# EAGLE design Block Manager Rev D1 (EAGLE 7.2.0)

## Sheet 1 of 2
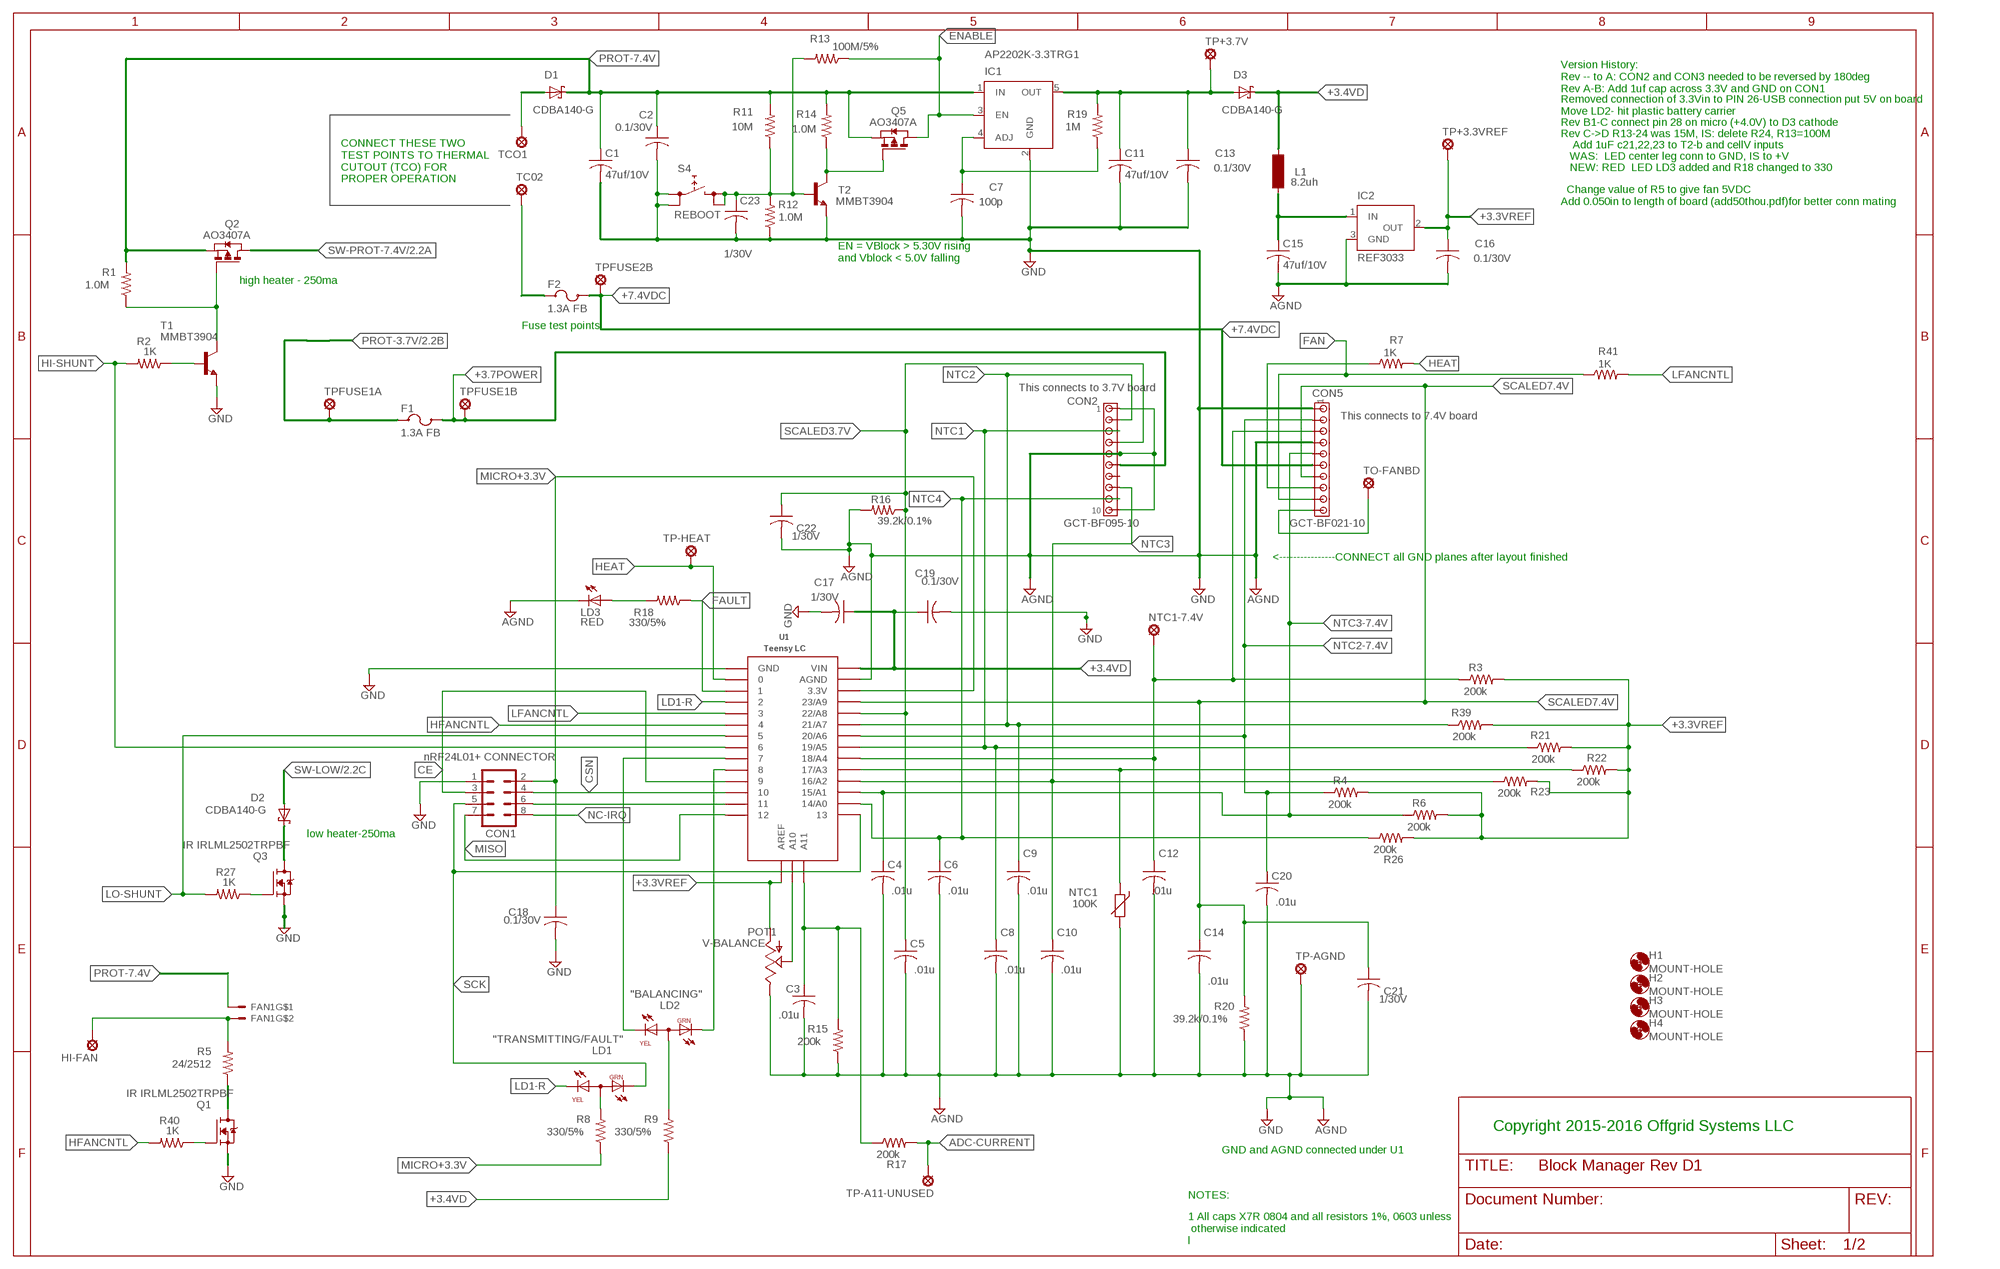
[diagram p0: schematic, sheet 1]

### Parts
C1  47uf/10V  C-USC0805K  [C0805K]
C2  0.1/30V  TIMS_INDUCTOR_C-USC0805  [TIMS_INDUCTOR_C0805]
C3  .01u  TIMS_INDUCTOR_C-USC0805  [TIMS_INDUCTOR_C0805]
C4  .01u  TIMS_INDUCTOR_C-USC0805  [TIMS_INDUCTOR_C0805]
C5  .01u  TIMS_INDUCTOR_C-USC0805  [TIMS_INDUCTOR_C0805]
C6  .01u  TIMS_INDUCTOR_C-USC0805  [TIMS_INDUCTOR_C0805]
C7  100p  TIMS_INDUCTOR_C-USC0805  [TIMS_INDUCTOR_C0805]
C8  .01u  TIMS_INDUCTOR_C-USC0805  [TIMS_INDUCTOR_C0805]
C9  .01u  TIMS_INDUCTOR_C-USC0805  [TIMS_INDUCTOR_C0805]
C10  .01u  TIMS_INDUCTOR_C-USC0805  [TIMS_INDUCTOR_C0805]
C11  47uf/10V  C-USC0805K  [C0805K]
C12  .01u  TIMS_INDUCTOR_C-USC0805  [TIMS_INDUCTOR_C0805]
C13  0.1/30V  TIMS_INDUCTOR_C-USC0805  [TIMS_INDUCTOR_C0805]
C14  .01u  TIMS_INDUCTOR_C-USC0805  [TIMS_INDUCTOR_C0805]
C15  47uf/10V  C-USC0805K  [C0805K]
C16  0.1/30V  TIMS_INDUCTOR_C-USC0805  [TIMS_INDUCTOR_C0805]
C17  1/30V  TIMS_INDUCTOR_C-USC0805  [TIMS_INDUCTOR_C0805]
C18  0.1/30V  TIMS_INDUCTOR_C-USC0805  [TIMS_INDUCTOR_C0805]
C19  0.1/30V  TIMS_INDUCTOR_C-USC0805  [TIMS_INDUCTOR_C0805]
C20  .01u  TIMS_INDUCTOR_C-USC0805  [TIMS_INDUCTOR_C0805]
C21  1/30V  TIMS_INDUCTOR_C-USC0805  [TIMS_INDUCTOR_C0805]
C22  1/30V  TIMS_INDUCTOR_C-USC0805  [TIMS_INDUCTOR_C0805]
C23  1/30V  TIMS_INDUCTOR_C-USC0805  [TIMS_INDUCTOR_C0805]
CON1  nRF24L01+ CONNECTOR  MA04-2  [MA04-2]
CON2  GCT-BF095-10  [GCT-BF085-10]
CON5  GCT-BF021-10  [GCT-BF021-10]
D1  CDBA140-G  [DO214AC]
D2  CDBA140-G  [DO214AC]
D3  CDBA140-G  [DO214AC]
F1  1.3A FB  TE-0603SFV125F  [TE-0603SFV125F]
F2  1.3A FB  TE-0603SFV125F  [TE-0603SFV125F]
FAN1  30mm fan  30X30MMFAN  [30X30MMFAN]
H1  MOUNT-HOLE  [2,6]
H2  MOUNT-HOLE  [2,6]
H3  MOUNT-HOLE  [2,6]
H4  MOUNT-HOLE  [2,6]
HI-FAN  LSP10  [LSP10]
IC1  AP2202K-3.3TRG1  MIC5205  [SOT23-5]
IC2  REF3033  MAX6520  [SOT23]
L1  8.2uh  SM-1206  [SM-1206]
LD1  "TRANSMITTING/FAULT"  KINGBRIGHT-APBA3010  [SUN-XZMDKVG56W]
LD2  "BALANCING"  KINGBRIGHT-APBA3010  [SUN-XZMDKVG56W]
LD3  RED  LITEON-LTST-S270KRKT  [LITEON-LTST-S270KRKT]
NTC1  100K  NTC-MURATA-NCP18WF104J03RB  [0603]
NTC1-7.4V  LSP10  [LSP10]
POT1  V-BALANCE  BOURNS-3361-RA  [BOURNS-3361-RA]
Q1  IRLML2502TRPBF  IRLML2060TRPBF  [SOT23]
Q2  AO3407A  [SOT23-BIGPADS]
Q3  IRLML2502TRPBF  IRLML2060TRPBF  [SOT23]
Q5  AO3407A  [SOT23-BIGPADS]
R1  1.0M  R-US_R0603  [R0603]
R2  1K  R-US_R0603  [R0603]
R3  200k  R-US_R0603  [R0603]
R4  200k  R-US_R0603  [R0603]
R5  24/2512  R-US_R2512  [R2512]
R6  200k  R-US_R0603  [R0603]
R7  1K  R-US_R0603  [R0603]
R8  330/5%  R-US_R0603  [R0603]
R9  330/5%  R-US_R0603  [R0603]
R11  10M  R-US_R0603  [R0603]
R12  1.0M  R-US_R0603  [R0603]
R13  100M/5%  R-US_R0603  [R0603]
R14  1.0M  R-US_R0603  [R0603]
R15  200k  R-US_R0603  [R0603]
R16  39.2k/0.1%  R-US_R0603  [R0603]
R17  200k  R-US_R0603  [R0603]
R18  330/5%  R-US_R0603  [R0603]
R19  1M  R-US_R0603  [R0603]
R20  39.2k/0.1%  R-US_R0603  [R0603]
R21  200k  R-US_R0603  [R0603]
R22  200k  R-US_R0603  [R0603]
R23  200k  R-US_R0603  [R0603]
R26  200k  R-US_R0603  [R0603]
R27  1K  R-US_R0603  [R0603]
R39  200k  R-US_R0603  [R0603]
R40  1K  R-US_R0603  [R0603]
R41  1K  R-US_R0603  [R0603]
S4  REBOOT  PTS645  [PTS645]
T1  MMBT3904  MMBT3904LT1-NPN-SOT23-BEC  [SOT23-BEC]
T2  MMBT3904  MMBT3904LT1-NPN-SOT23-BEC  [SOT23-BEC]
TC02  SOLPAD1.2MMDRILL  [SOLPADWITH1.2MMDRILL]
TCO1  SOLPAD1.2MMDRILL  [SOLPADWITH1.2MMDRILL]
TO-FANBD  LSP10  [LSP10]
TP+3.3VREF  LSP10  [LSP10]
TP+3.7V  LSP10  [LSP10]
TP-A11-UNUSED  LSP10  [LSP10]
TP-AGND  LSP10  [LSP10]
TP-HEAT  LSP10  [LSP10]
TPFUSE1A  LSP10  [LSP10]
TPFUSE1B  LSP10  [LSP10]
TPFUSE2B  LSP10  [LSP10]
U1  Teensy LC  TEENSY_3.0-DIP+ANALOG  [TEENSY_3.0-DIP+ANALOG]

### Nets
4VREFIN: C15.1 IC2.1(IN) L1.1
+3.3VREF: C16.1 IC2.2(OUT) POT1.1(A) R3.2 R4.2 R6.2 R21.2 R22.2 R23.2 R26.2 R39.2 TP+3.3VREF.MP U1.AREF
+3.4VD: C17.1 C19.1 D3.C L1.2 R9.1 U1.VIN
+3.7POWER: CON2.P$6 F1.P$2(2A) TPFUSE1B.MP
+4.5V: C11.1 C13.1 D3.A IC1.5(OUT) R19.2 TP+3.7V.MP
+7.4VDC: CON5.P$6 F2.P$2(2A) TPFUSE2B.MP
ADC-CURRENT: R17.2 TP-A11-UNUSED.MP
ADS: D2.C Q3.3(D)
CE: CON1.3 U1.9
CSN: CON1.4 U1.10
ENABLE: IC1.3(EN) Q5.2(D) R13.1
FAN: CON5.P$9 R41.1
FAULT: R18.1 U1.1
GND: C1.2 C2.2 C3.2 C4.2 C5.2 C6.2 C7.2 C8.2 C9.2 C10.2 C11.2 C12.2 C13.2 C14.2 C15.2 C16.2 C17.2 C18.2 C19.2 C20.2 C21.2 C22.2 C23.2 CON1.1 CON2.P$1 CON2.P$5 CON2.P$10 CON5.P$1 CON5.P$4 IC1.2(GND) IC2.3(GND) LD3.CATHODE(C) NTC1.2 POT1.3(E) Q1.2(S) Q3.2(S) R12.1 R15.1 R16.2 R20.1 S4.1 S4.2 T1.E T2.E TP-AGND.MP U1.AGND U1.GND ; supply symbol labelled AGND
HEAT: R7.2 TP-HEAT.MP U1.0
HEATER: CON5.P$8 R7.1
HFANCNTL: R40.2 U1.4
HI-SHUNT: R2.2 U1.6
LD1-R: LD1.2-CATH-RED(CR) U1.2
LFANCNTL: R41.2 U1.3
LO-SHUNT: R27.2 U1.5
MICRO+3.3V: C18.1 CON1.2 R8.1 U1.3.3V
MISO: CON1.7 U1.12
MOSI: CON1.6 U1.11
N$1: LD3.ANODE(A) R18.2
N$2: D1.A TCO1.MP
N$3: NTC1.1 R22.1 U1.17/A3
N$5: Q2.1(G) R1.1 T1.C
N$9: Q1.3(D) R5.1
N$13: LD2.3-CATH-GRN(CG) U1.8
N$14: LD2.2-CATH-RED(CR) U1.7
N$19: LD1.1-ANODE(A) R8.2
N$20: F2.P$1(1A) TC02.MP
N$21: Q1.1(G) R40.1
N$23: Q3.1(G) R27.1
N$24: C23.1 R11.1 R12.2 R13.2 S4.3 S4.4 T2.B
N$26: C7.1 IC1.4(ADJ) R19.1
N$27: Q5.1(G) R14.1 T2.C
N$28: R2.1 T1.B
N$31: FAN1.2 HI-FAN.MP R5.2
NC-IRQ: CON1.8
NTC1: C8.1 CON2.P$3 R21.1 U1.19/A5
NTC1-7.4V: C12.1 CON5.P$3 NTC1-7.4V.MP R3.1 U1.18/A4
NTC2: C9.1 CON2.P$2 R39.1 U1.21/A7
NTC2-7.4V: C20.1 CON5.P$2 R4.1 U1.20/A6
NTC3: C10.1 CON2.P$8 R23.1 U1.16/A2
NTC3-7.4V: C4.1 CON5.P$5 R6.1 U1.15/A1
NTC4: C6.1 CON2.P$9 R26.1 U1.14/A0
OPENFANBD-PIN: CON5.P$10 TO-FANBD.MP
PROT-3.7V: F1.P$1(1A) TPFUSE1A.MP ; also sheet 2
PROT-7.4V: C1.1 C2.1 D1.C FAN1.1 IC1.1(IN) Q2.3(S) Q5.3(S) R1.2 R11.2 R14.2
SCALED3.7V: C5.1 C22.1 CON2.P$4 R16.1 U1.22/A8
SCALED7.4V: C14.1 C21.1 CON5.P$7 R20.2 U1.23/A9
SCK: CON1.5 LD1.3-CATH-GRN(CG) U1.13
SW-LOW: D2.A ; also sheet 2
SW-PROT-7.4V: Q2.2(D) ; also sheet 2
T: LD2.1-ANODE(A) R9.2
UNUSED-ADC: C3.1 R15.2 R17.1 U1.A11
VBALANCE: POT1.2(S) U1.A10
Unconnected: CON2.P$7

### Notes on the sheet
- Version History:
  Rev -- to A: CON2 and CON3 needed to be reversed by 180deg
  Rev A-B: Add 1uf cap across 3.3V and GND on CON1
- Removed connection of 3.3Vin to PIN 26-USB connection put 5V on board
  Move LD2- hit plastic battery carrier
- Rev B1-C connect pin 28 on micro (+4.0V) to D3 cathode
- Rev C->D R13-24 was 15M, IS: delete R24, R13=100M
- Add 1uF c21,22,23 to T2-b and cellV inputs
- WAS:  LED center leg conn to GND, IS to +V
- NEW: RED  LED LD3 added and R18 changed to 330
- CONNECT THESE TWO
  TEST POINTS TO THERMAL 
  CUTOUT (TCO) FOR 
  PROPER OPERATION
- Change value of R5 to give fan 5VDC 
  Add 0.050in to length of board (add50thou.pdf)for better conn mating
- EN = VBlock > 5.30V rising
  and Vblock < 5.0V falling
- high heater - 250ma
- Fuse test points
- This connects to 3.7V board
- This connects to 7.4V board
- <----------------CONNECT all GND planes after layout finished
- low heater-250ma
- Copyright 2015-2016 Offgrid Systems LLC
- GND and AGND connected under U1
- NOTES:
- 1 All caps X7R 0804 and all resistors 1%, 0603 unless
   otherwise indicated
  l

## Sheet 2 of 2: Shunt/heater
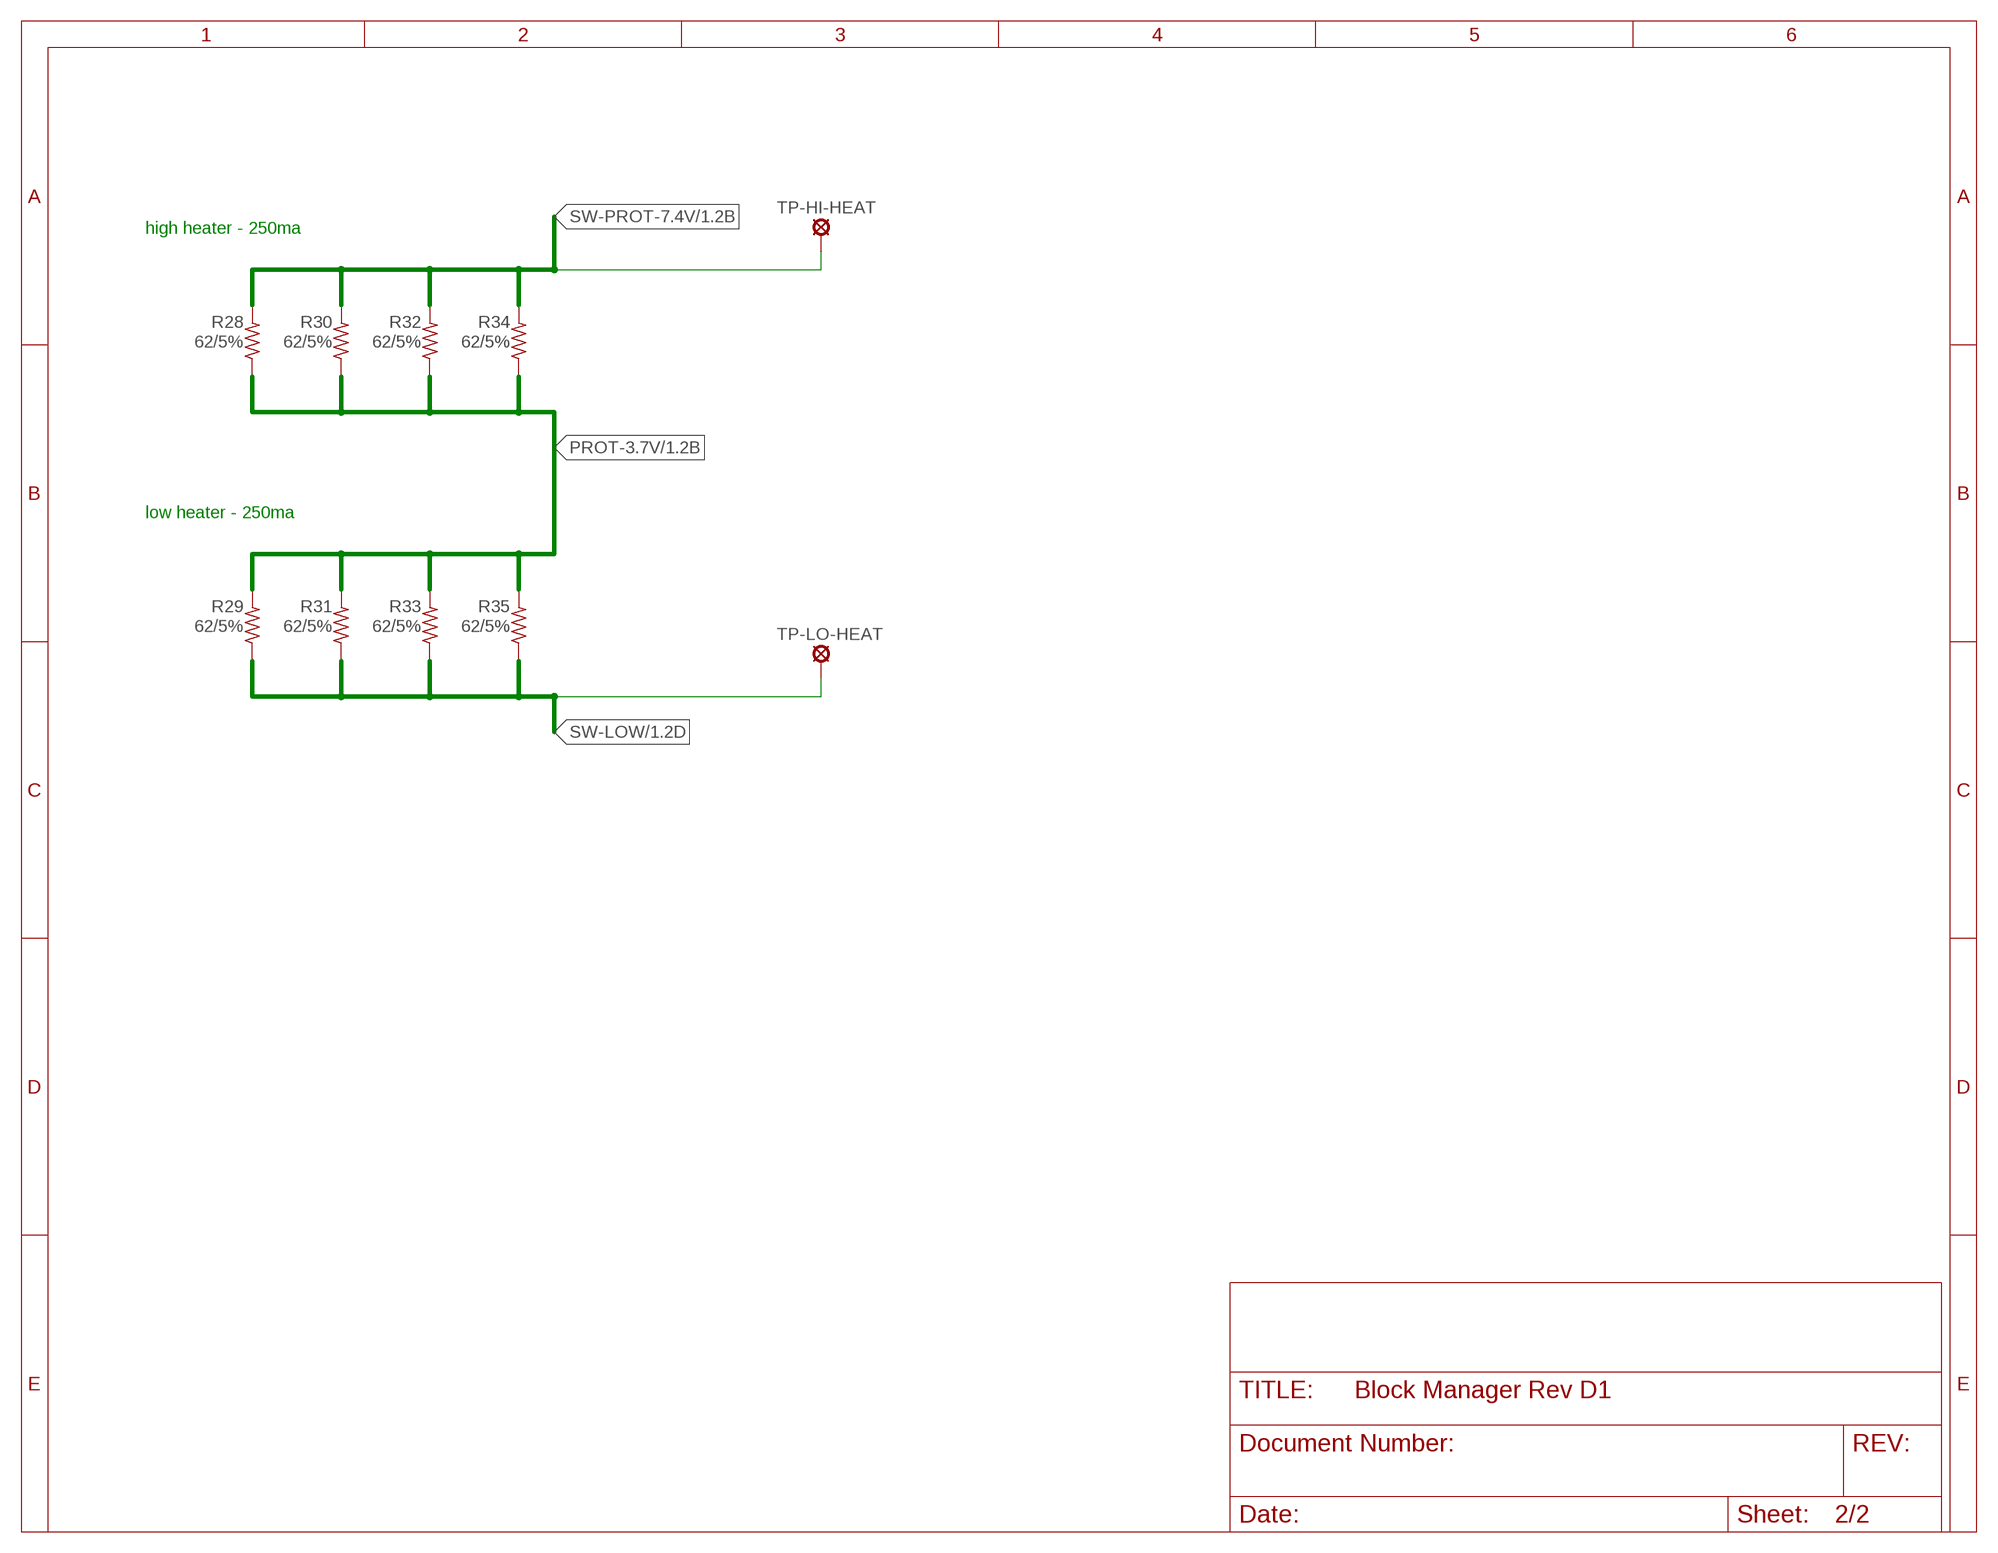
[diagram p1: schematic, sheet 2]

### Parts
R28  62/5%  R-US_R2512  [R2512]
R29  62/5%  R-US_R2512  [R2512]
R30  62/5%  R-US_R2512  [R2512]
R31  62/5%  R-US_R2512  [R2512]
R32  62/5%  R-US_R2512  [R2512]
R33  62/5%  R-US_R2512  [R2512]
R34  62/5%  R-US_R2512  [R2512]
R35  62/5%  R-US_R2512  [R2512]
TP-HI-HEAT  LSP10  [LSP10]
TP-LO-HEAT  LSP10  [LSP10]

### Nets
PROT-3.7V: R28.1 R29.2 R30.1 R31.2 R32.1 R33.2 R34.1 R35.2 ; also sheet 1
SW-LOW: R29.1 R31.1 R33.1 R35.1 TP-LO-HEAT.MP ; also sheet 1
SW-PROT-7.4V: R28.2 R30.2 R32.2 R34.2 TP-HI-HEAT.MP ; also sheet 1

### Notes on the sheet
- high heater - 250ma
- low heater - 250ma

## Library data of the parts
C1 C15 = offgrid rcl:C-US: CAPACITOR, American symbol; 1KPRICE: .271; MPN: Murata GRM21BR61A476ME15L
C2 = Power_board:TIMS_INDUCTOR_C-US: CAPACITOR, American symbol; 100PCPRICE: .022; 1KPRICE: .012; MPN: Kemet C0805C104K5RACTU
C3-C6 C8-C10 C12 C14 C18-C20 = Power_board:TIMS_INDUCTOR_C-US: CAPACITOR, American symbol; MPN: Kemet C0805C103K5RACTU
C7 C13 C16 C17 C21-C23 = Power_board:TIMS_INDUCTOR_C-US: CAPACITOR, American symbol; MPN: Kemet C0805C104K5RACTU
C11 = offgrid rcl:C-US: CAPACITOR, American symbol; 100PCPRICE: .39; 1KPRICE: .271; MPN: Murata GRM21BR61A476ME15L
CON1 = con-lstb:MA04-2: PIN HEADER; 100PCPRICE: 0.53; 1KPRICE: 0.38; MPN: Precidip 803-87-008-10-012101; OC_FARNELL: unknown; OC_NEWARK: unknown
CON2 = offgrid con-amp:GCT-BF095-10: GCT Bf095 series 2.00mm 2mm socket single row through hole vertical THP
CON5 = offgrid con-amp:GCT-BF021-10: GCT BF021-10 also Sullins 40 pos header NRPN401PARN-RC conn header 2mm single RA through hole horizontal
D1-D3 = offgrid diode:CDBA140-G: Comchip CDBA140-G DIODE SCHOTTKY 40V 1A DO214AC; 100PCPRICE: .187; 1KPRICE: .068; MPN: comchip CDBA140-G
F1 = offgrid fuse:TE-0603SFV125F: TE connectivity pn 0603SFV125F which is a SMT 0603 fuse rated at 32VDC and 1.3Amps, fast blow. Note that this fuse comes in many different ratings.; 100PCPRICE: .20; 1KPRICE: .134; MPN: TE 0603SFV125F/32-2
F2 = offgrid fuse:TE-0603SFV125F: TE connectivity pn 0603SFV125F which is a SMT 0603 fuse rated at 32VDC and 1.3Amps, fast blow. Note that this fuse comes in many different ratings.; 100PCPRICE: .20; 1KPRICE: .134; MPN: TE 0603SFV125F
FAN1 = offgrid con-molex:30X30MMFAN: 30mm x 30mm fan with 24mm holes on center; MPN-FAN: TBD
H1-H4 = holes:MOUNT-HOLE: MOUNTING HOLE with drill center marker
HI-FAN NTC1-7.4V TO-FANBD TP+3.3VREF TP+3.7V TP-A11-UNUSED TP-AGND TP-HEAT TP-HI-HEAT TP-LO-HEAT TPFUSE1A TPFUSE1B TPFUSE2B = solpad:LSP10: SOLDER PAD drill 1.0 mm, distributor Buerklin, 12H555
IC1 = offgrid v-reg-micrel:MIC5205: VOLTAGE REGULATOR; 100PCPRICE: .23; 1KPRICE: .103; MF: Diodes INc; MPN: Diodes AP2202K-3.3TRG1; OC_FARNELL: 1100656; OC_NEWARK: 09J8939
IC2 = maxim:MAX6520: 1.2V Voltage Reference 50ppm/°C, SOT23, 3-Terminal Source: Data sheet <http://datasheets.maxim-ic.com/en/ds/MAX6520.pdf>; 100PCPRICE: 1.25; 1KPRICE: .675; MF: MAXIM; MPN: TI REF3033AIDBZR; OC_FARNELL: unknown; OC_NEWARK: 02J4586
L1 = offgrid-inductor-neosid:SM-1206: INDUCTOR SMD chip inductor; 100PCPRICE: .136; 1KPRICE: .10; MPN: Abracon AIML-1206-8R2K-T
LD1 LD2 = led:KINGBRIGHT-APBA3010; MPN: Kingbright APBA3010SYKCGKC-GX
LD3 = offgrid led:LITEON-LTST-S270KRKT: LITEON-LTST-S270KRKT side looking SMT on a slightly smaller than 0805 pad; MPN: LITEON-LTST-S270KRKT
NTC1 = offgrid varistor:NTC-MURATA-NCP18WF104J03RB: Murata NCP18WF104J03RB 100K NTC 5%; 100PCPRICE: .106; 1KPRICE: .07999; MPN: MURATA NCP18WF104J03RB
POT1 = offgrid pot:BOURNS-3361-RA: Bourns 1/4" square SMD trimpot pot trimming potentiometer in right angle mount; MPN: Bourns 3361S-1-104GLF
Q1 Q3 = offgrid transistor-fet:IRLML2060TRPBF: IR IRLML2060TRPbF low cost MOSFET in SOT23, 1.5A, 500mohm N channel 60V; 100PCPRICE: .144; 1KPRICE: .11; MPN: IR IRLML2502TRPBF
Q2 = offgrid zetex:AO3407A: P channel MOSFET or pmos with larger pads in SOT23 or SOT-23 3 in package; 100PCPRICE: .203; 1KPRICE: .092; MPN: Alpha AO3407A
Q5 = offgrid zetex:AO3407A: P channel MOSFET or pmos with larger pads in SOT23 or SOT-23 3 in package
R1 R12 R14 R19 = rcl:R-US_: RESISTOR, American symbol; 100PCPRICE: .0187; 1KPRICE: .0084; MPN: Bourns CR0603-FX-1004ELF
R2 R7 R27 R40 R41 = rcl:R-US_: RESISTOR, American symbol; 100PCPRICE: .018; 1KPRICE: .0084; MPN: Bourns CR0603-FX-1001ELF
R3 R4 R6 R17 R21-R23 R26 R39 = rcl:R-US_: RESISTOR, American symbol; 100PCPRICE: .018; 1KPRICE: .007; MPN: Bourns CR0603-FX-2003ELF
R5 = rcl:R-US_: RESISTOR, American symbol; 100PCPRICE: .12; 1KPRICE: .05; MPN: Rohm MCR100JZHJ240
R8 = rcl:R-US_: RESISTOR, American symbol; 100PCPRICE: .011; 1KPRICE: .005; MPN: Bourns CR0603-JW-331ELF
R9 = rcl:R-US_: RESISTOR, American symbol; MPN: Bourns CR0603-JW-331ELF
R11 = rcl:R-US_: RESISTOR, American symbol; 100PCPRICE: .0117; 1KPRICE: .00525; MPN: Bourns CR0603-JW-106ELF
R13 = rcl:R-US_: RESISTOR, American symbol; 100PCPRICE: .1276; 1KPRICE: .007040; MPN: Stackpole HMC0603JT100M
R15 R18 = rcl:R-US_: RESISTOR, American symbol; 100PCPRICE: .18; 1KPRICE: .07; MPN: Bourns CR0603-FX-2003ELF
R16 R20 = rcl:R-US_: RESISTOR, American symbol; 100PCPRICE: .161; 1KPRICE: .079; MPN: Susumu RG1608P-3922-B-T5
R28-R35 = rcl:R-US_: RESISTOR, American symbol; 100PCPRICE: .12; 1KPRICE: .05; MPN: Rohm MCR100JZHJ620
S4 = offgrid switch:PTS645; 100PCPRICE: 0.176; 1KPRICE: 0.11; MPN: C&k PTS645SM43SMTR92 LFS
T1 T2 = offgrid transistor:*-NPN-: NPN Transistror BF959 corrected 2008.03.06; 100PCPRICE: .062; 1KPRICE: .02; MPN: NXP MMBT3904,215
TC02 TCO1 = solpad:SOLPAD1.2MMDRILL
U1 = Teensy3.0v1.1:TEENSY_3.0-DIP+ANALOG: Teensy 3.0, 3.1 PCB layout with 0.043 holes for .025sq pins; 1KPRICE: 9.99; LOPROFILE-PINHEADER: Millmax 800-10-045-10-002000; LOPROFILE-SOCKET: Precidip 315-87-160-41-003101; MATCHING-SOCKET: 3M 929850-01-13-RA; MPN: OshPark Teensy 3.1; PIN-HEADER: TE Conn 1-644456-3

## Board
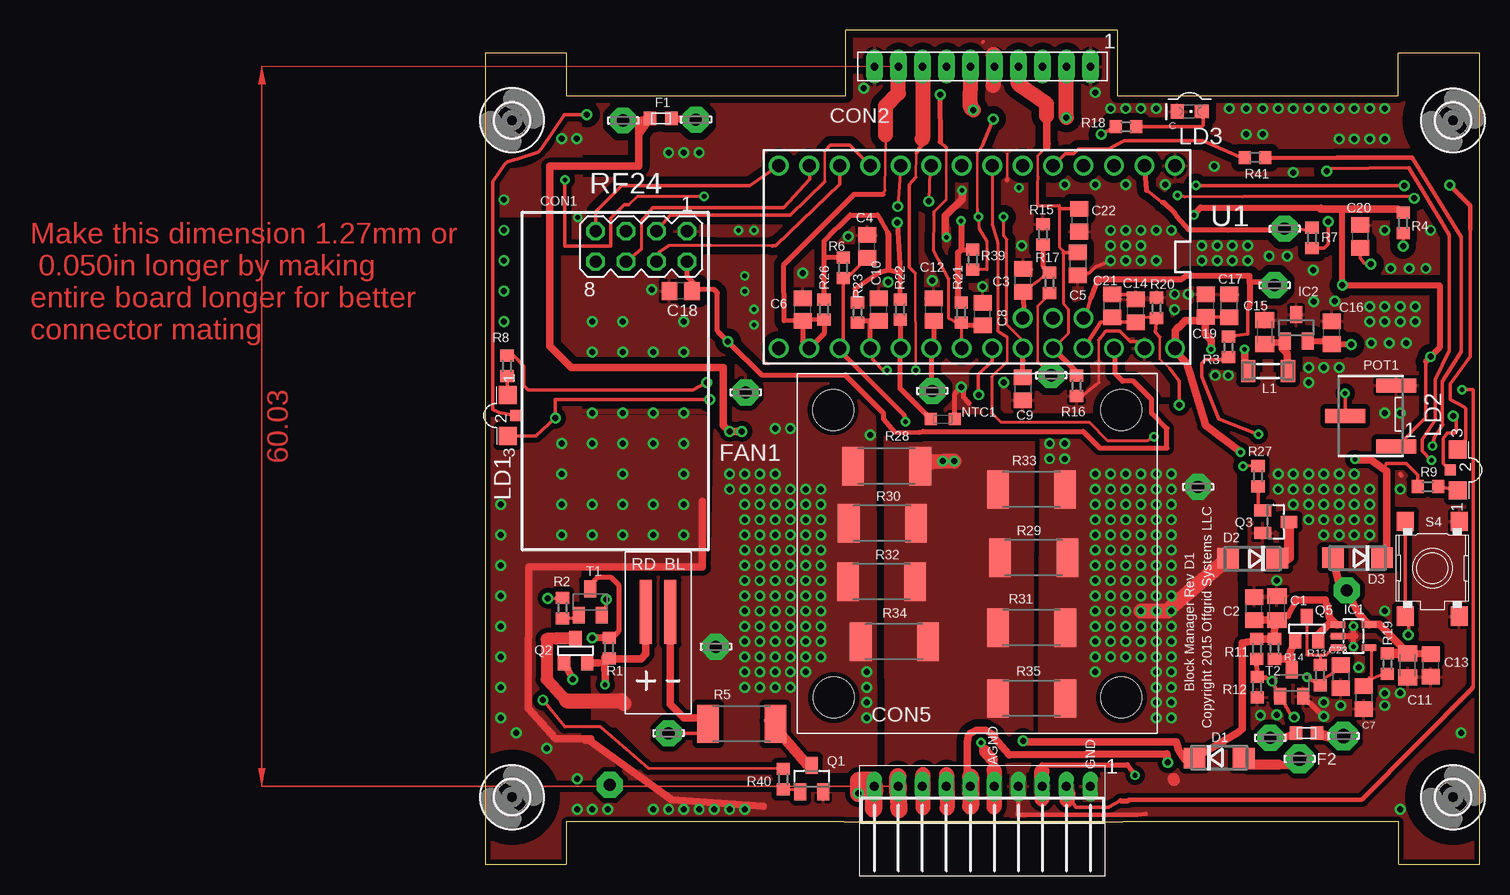
[diagram p2: board, top side]
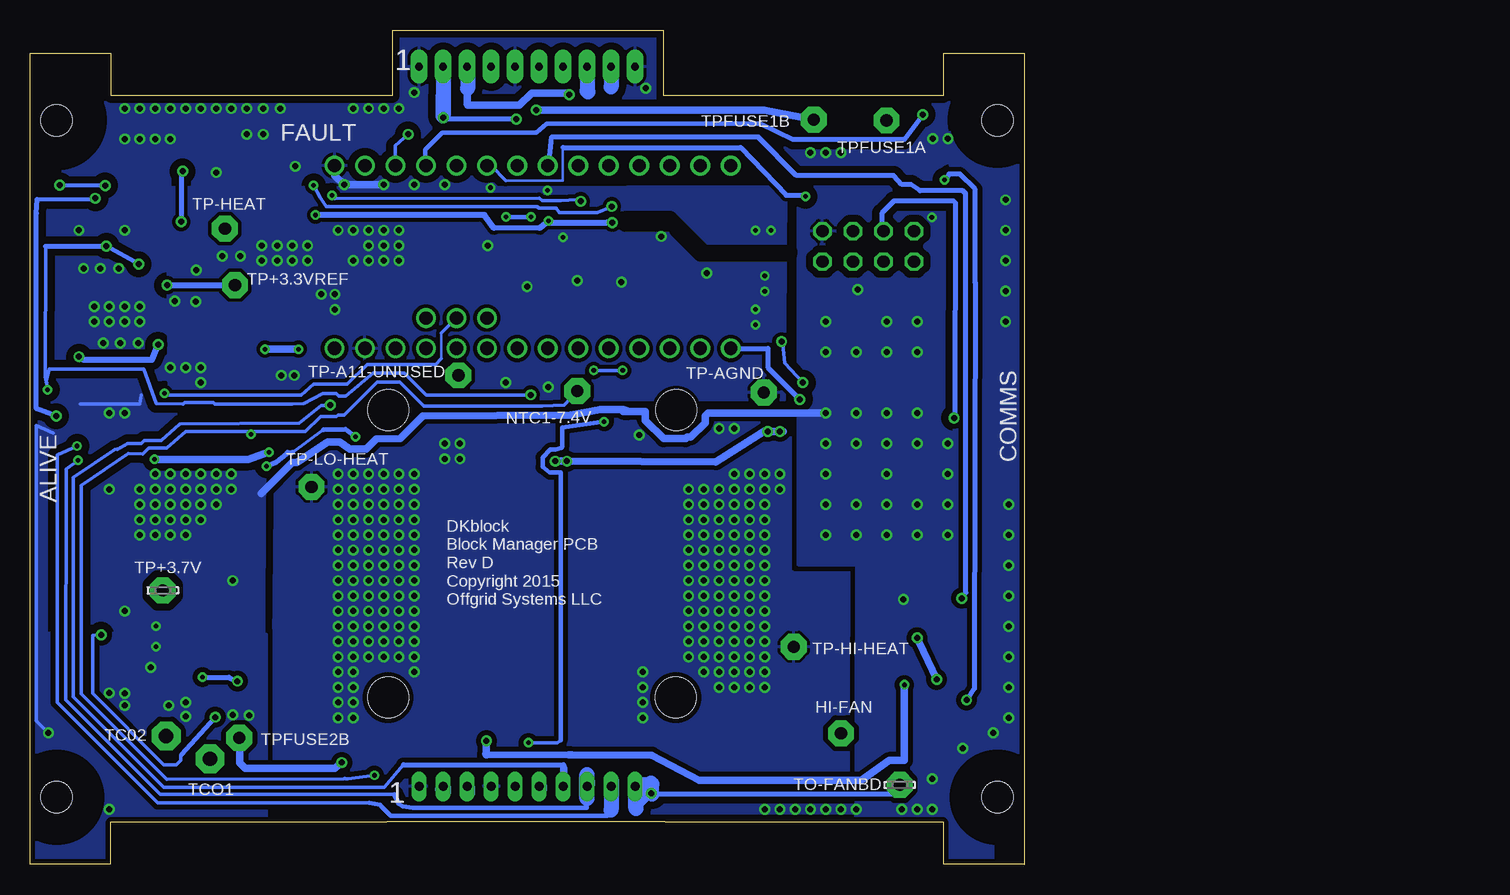
[diagram p3: board, bottom side, seen from below]

Size 82.85 x 69.59 mm. Coordinates in mm from the lower left corner, seen from the top.
Outline: 82.85,0.01 82.85,67.67 76.09,67.67 76.09,64.11 52.64,64.12 52.64,69.59 30.05,69.59 30.05,64.11 6.75,64.11 6.75,67.67 0.01,67.67 0.01,0
Outline: 0,0.01 6.76,0.01 6.76,3.56 29.76,3.56 29.92,3.56 53.1,3.56 53.1,3.56 76.1,3.56 76.1,0.01 82.85,0.01
Copper layers (1*16): Top 0.035mm / dielectric 1.5mm / Bottom 0.035mm
Design rules "Tims design rules for low voltage boards up to 48VDC for BM board": minimum track width 9mil, minimum drill 15mil, track to track 11mil, track to pad 11mil, pad to pad 11mil, via to via 11mil, smd to smd 4mil, copper to edge 12mil, drill to drill 5mil, minimum pad ring 10mil, minimum via ring 8mil, stop-mask expansion 4mil, vias tented up to drill 30mil, thermal gap 10mil
bRestrict: area 19.8,50.9 to 33.2,53.9

### Footprints (pad centres in the part's own frame; a part is rotated, then mirrored left to right if it is on the bottom)
C0805K = smd 1.3 x 1.6: 1 -1,0; 2 1,0
TIMS_INDUCTOR_C0805 = smd 1.3 x 1.5: 1 -0.95,0; 2 0.95,0
MA04-2 = drill 1.016 octagon: 1 -3.81,-1.27; 2 -3.81,1.27; 3 -1.27,-1.27; 4 -1.27,1.27; 5 1.27,-1.27; 6 1.27,1.27; 7 3.81,-1.27; 8 3.81,1.27
GCT-BF085-10 = drill 0.66 pad 1.422 long: P$1 9,0; P$2 7,0; P$3 5,0; P$4 3,0; P$5 1,0; P$6 -1,0; P$7 -3,0; P$8 -5,0; P$9 -7,0; P$10 -9,0
GCT-BF021-10 = drill 0.75 long: P$1 9,-0.5; P$2 7,-0.5; P$3 5,-0.5; P$4 3,-0.5; P$5 1,-0.5; P$6 -1,-0.5; P$7 -3,-0.5; P$8 -5,-0.5; P$9 -7,-0.5; P$10 -9,-0.5
DO214AC = smd 1.8 x 1.7: A 2.05,0; C -2.05,0
TE-0603SFV125F = smd 1.092 x 1.092: P$1 -0.908,0; P$2 0.861,0
30X30MMFAN = smd 1 x 5.334: 1 -27.54,-5.415; 2 -25.5,-5.415 | hole 3.404: -11.942,11.438; 12.067,11.433; -11.887,-12.532; 12.082,-12.537
2,6 = hole 2.591: 0,0
LSP10 = drill 1.016 pad 2.159 octagon: MP 0,0
SOT23-5 = smd 0.55 x 1.2: 1 -0.95,-1.3; 2 0,-1.3; 3 0.95,-1.3; 4 0.95,1.3; 5 -0.95,1.3
SOT23 = smd 1 x 1.4: 1 -0.95,-1.1; 2 0.95,-1.1; 3 0,1.1
SM-1206 = smd 1.2 x 1.8: 1 -1.65,0; 2 1.65,0
SUN-XZMDKVG56W = smd 1.5 x 1.5: 1-ANODE -1.72,0; 3-CATH-GRN 1.72,0 | smd 0.9 x 0.9: 2-CATH-RED 0,0.65
LITEON-LTST-S270KRKT = smd 1.1 x 1.2: ANODE 0,1 | smd 1.2 x 1.1: CATHODE 0,-1.05
0603 = smd 1 x 1: 1 -1,0; 2 1,0
BOURNS-3361-RA = smd 3.302 x 1.194: 1 2.127,-2.547; 2 -2.127,0; 3 2.127,2.547
SOT23-BIGPADS = smd 1.016 x 1.27: 1 0.991,1.016; 2 0.025,-1.016; 3 -0.94,1.016
R0603 = smd 1 x 1.1: 1 -0.85,0; 2 0.85,0
R2512 = smd 1.8 x 3.2: 1 -2.8,0; 2 2.8,0
PTS645 = smd 1.6 x 1.4: 1 -4.2,2.25; 2 3.7,2.25; 3 -4.2,-2.25; 4 3.7,-2.25
SOT23-BEC = smd 1 x 1.4: B -0.95,-1.1; C 0,1.1; E 0.95,-1.1
SOLPADWITH1.2MMDRILL = drill 1.2 pad 2.4 octagon: MP 0,0
TEENSY_3.0-DIP+ANALOG = drill 1.1: 0 -7.62,13.97; 1 -7.62,11.43; 2 -7.62,8.89; 3 -7.62,6.35; 3.3V 7.62,11.43; 4 -7.62,3.81; 5 -7.62,1.27; 6 -7.62,-1.27; 7 -7.62,-3.81; 8 -7.62,-6.35; 9 -7.62,-8.89; 10 -7.62,-11.43; 11 -7.62,-13.97; 12 -7.62,-16.51; 13 7.62,-16.51; 14/A0 7.62,-13.97; 15/A1 7.62,-11.43; 16/A2 7.62,-8.89; 17/A3 7.62,-6.35; 18/A4 7.62,-3.81; 19/A5 7.62,-1.27; 20/A6 7.62,1.27; 21/A7 7.62,3.81; 22/A8 7.62,6.35; 23/A9 7.62,8.89; A10 5.08,6.35; A11 5.08,3.81; AGND 7.62,13.97; AREF 5.08,8.89; GND -7.62,16.51; VIN 7.62,16.51

### Placement (x,y rotation side)
C1  65.96,21.39 90 top
C2  64.06,21.34 90 top
C3  44.81,48.72 90 top
C4  31.81,51.54 90 top
C5  49.36,50.09 270 top
C6  26.44,46.28 90 top
C7  73.2,13.92 270 top
C8  41.43,45.9 90 top
C9  44.79,39.67 270 top
C10  32.79,46.28 90 top
C11  76.86,16.61 270 top
C12  37.36,46.28 90 top
C13  78.77,16.61 270 top
C14  54.2,46.18 90 top
C15  64.95,44.4 90 top
C16  70.54,44.35 90 top
C17  62,46.58 90 top
C18  16.28,47.8 180 top
C19  60.05,46.61 90 top
C20  72.92,52.38 90 top
C21  52.25,46.58 90 top
C22  49.51,53.72 270 top
C23  71.27,15.67 270 top
CON1  13,51.54 180 top
CON2  41.43,66.54 0 top
CON5  41.42,7.01 0 top
D1  61.15,8.89 0 top
D2  63.94,25.53 180 top
D3  72.67,25.58 180 top
DRILEGEND  [DRILEGEND]  12.85,-8.09 0 top  (outside the outline)
F1  14.63,62.22 0 top
F2  68.4,10.95 180 top
FAN1  40.92,26.47 0 top
H1  2.22,5.62 0 top
H2  80.64,5.62 0 top
H3  80.63,62.05 0 top
H4  2.22,62.05 0 top
HI-FAN  15.27,10.95 0 top
IC1  72.34,19.05 270 top
IC2  67.56,44.76 0 top
L1  65.23,41.15 180 top
LD1  1.86,37.44 270 top
LD2  81.05,32.89 90 top
LD3  58.7,62.79 270 top
NTC1  38.13,37.13 0 top
NTC1-7.4V  37.24,39.49 0 top
POT1  73.78,37.4 0 top
Q1  27.2,7.16 0 top
Q2  7.54,17.83 180 top
Q3  65.87,28.58 270 top
Q5  68.48,19.66 180 top
R1  10.31,18.06 270 top
R2  6.43,21.39 90 top
R3  61.93,43.15 90 top
R4  76.48,53.49 90 top
R5  21.36,11.73 180 top
R6  29.82,49.76 90 top
R7  68.89,52.25 90 top
R8  1.8,41.58 270 top
R9  78.54,31.52 0 top
R11  64.29,17.98 90 top
R12  64.31,14.78 90 top
R13  69.57,15.8 270 top
R14  65.76,17.98 90 top
R15  46.46,52.56 270 top
R16  49.27,39.93 270 top
R17  47.02,48.51 270 top
R18  53.39,61.52 0 top
R19  75.16,16.74 90 top
R20  55.93,46.41 270 top
R21  39.65,46.02 90 top
R22  34.57,46.28 90 top
R23  31.01,46.02 90 top
R26  28.22,46.28 90 top
R27  64.39,32.39 90 top
R28  33.44,33.22 180 top
R29  45.7,25.59 180 top
R30  33.08,28.45 180 top
R31  45.52,19.77 180 top
R32  33.01,23.57 180 top
R33  45.51,31.27 180 top
R34  34.08,18.59 180 top
R35  45.52,13.86 180 top
R39  40.62,50.44 90 top
R40  24.82,7.11 90 top
R41  64.14,58.94 180 top
S4  78.92,24.41 270 top
T1  8.74,21.89 0 top
T2  67.21,15.14 0 top
TC02  71.5,10.72 0 top
TCO1  67.84,8.81 0 top
TO-FANBD  10.37,6.64 0 bottom
TP+3.3VREF  65.76,48.31 0 top
TP+3.7V  71.78,22.86 0 bottom
TP-A11-UNUSED  47.15,40.79 0 top
TP-AGND  21.69,39.37 0 top
TP-HEAT  66.6,53.02 0 top
TP-HI-HEAT  19.2,18.16 0 top
TP-LO-HEAT  59.39,31.5 0 top
TPFUSE1A  11.47,62.04 0 top
TPFUSE1B  17.54,62.12 0 top
TPFUSE2B  65.41,10.57 0 top
U1  40.96,50.66 270 top

### Tracks (layer width: path | path; a pad name or v marks a point on that pad's centre or on a via)
4VREFIN
  Top 0.305: IC2.1 65.2,43.66 C15.1 66.41,43.4
  Top 0.61: 66.41,43.4 66.41,43.02 66.83,42.6 66.83,41.2 L1.1
+3.3VREF  (via drill 0.38, 0.5)
  Top 0.305: 76.54,54.41 R4.2 | v71.43,48.31 71.43,48.16 | 71.4,54.46 71.6,54.66 | 69.92,43.66 C16.1 70.57,43.4 71.13,43.16 | 71.13,43.16 70.51,43.31 | 50.43,47.23 49.98,45.58 U1.AREF | 63.68,46.63 63.53,46.48 63.53,44.23 R3.2 | POT1.1 75.98,34.85 78.39,37.26 78.39,41.96 | 70.55,43.36 71.13,43.16
  Top 0.406: R22.2 34.57,49.33 | 34.57,49.33 33.55,49.58 32.79,49.33 30.81,48.01 30.76,47.13 R23.2 | R21.2 39.65,47.04 39.4,47.3 | R26.2 28.22,50.45 | 28.22,50.45 28.22,51.99 29.21,52.98 29.39,53.14 30.4,54.15 32.69,54.15 33.55,52.63 | v34.32,53.52 34.57,49.33 | TP+3.3VREF.MP 66.17,48.31 65.91,48.56 | 51.03,48.79 50.43,47.23 | 69.62,54.79 69.62,54.66 | 39.65,51.3 R39.2 | R6.2 28.38,50.61 28.22,50.45
  Top 0.508: 39.4,47.3 39.4,51.04 39.65,51.3 v39.65,53.67 | 33.55,52.63 33.55,49.58 | 65.91,48.56 63.68,48.51 | 63.68,48.51 63.68,49.07 58.4,49.07 57.99,48.79 51.03,48.79 | v59.06,54.15 59.59,54.79 69.62,54.79 | 71.43,48.16 71.4,49.58 71.4,54.46 | IC2.2 69.92,43.66 | 63.68,48.51 63.68,46.63 | 78.39,41.96 v78.77,42.34 79.53,43.1 79.53,48.31 v71.43,48.31 | v72.16,43.36 70.55,43.36
  Top 0.61: 69.62,54.66 71.6,54.66 74.25,54.66 | 74.25,54.66 76.05,54.66 76.38,54.33 76.63,54.37 R4.2 | 74.22,54.64 74.25,54.66
  Bottom 0.305: v78.77,42.34 78.39,42.09
  Bottom 0.406: 39.6,53.54 39.65,53.77 v39.65,53.67 39.68,53.64 | 34.77,53.54 v34.32,53.52 | 40.39,53.09 44.2,53.09
  Bottom 0.508: 39.6,53.54 34.77,53.54 | 39.68,53.64 40.39,53.09 | 44.2,53.09 44.98,54.15 v59.06,54.15 | v71.43,48.31 TP+3.3VREF.MP | 78.39,42.09 72.67,42.09 v72.16,43.36
+3.4VD  (via drill 0.38)
  Top 0.305: 59.59,45.3 C19.1 61.98,45.66 C17.1 | R9.1 77.69,32.5 76.73,33.45 75.08,33.45 75.08,33.34 74.79,33.05
  Top 0.406: U1.VIN 57.47,42.81 | 59.97,45.61 C19.1
  Top 0.61: 57.47,42.81 58.45,41.83 60.02,36.63 v62.94,34.39 | U1.VIN 57.47,44.54 57.76,44.83 57.84,44.83 58.34,45.34 59.55,45.34 C19.1 | v72.47,33.78 72.52,33.73 73.84,33.73 74.79,33.05 75.11,32.82 75.11,26.44 74.93,26.04 74.93,25.54 74.72,25.54 D3.C | v63.27,42.98 63.32,41.27 63.45,41.15 L1.2 | v60.48,42.98 60.48,43.74 59.97,44.25 59.97,45.61
  Bottom 0.61: v72.47,33.78 64.64,33.78 v62.94,34.39 | v63.27,42.98 v60.48,42.98
+3.7POWER  (via drill 0.5)
  Top 0.61: TPFUSE1B.MP 15.87,62.21 F1.P$2
  Top 1.27: CON2.P$6 40.43,65.51 40.41,63.48 40.41,63.17 v40.67,62.92
  Bottom 0.61: v40.67,62.92 21.65,62.92 TPFUSE1B.MP
+4.5V
  Top 0.61: D3.A 71.13,23.51 TP+3.7V.MP 72.78,20.9 IC1.5 73.83,20.04 74.52,20.04 74.7,19.86 74.7,19.84 75.36,19.18 75.36,19.15 76.71,17.81 C11.1 76.76,17.61 C13.1
  Top 0.813: C11.1 75.13,17.56 R19.2
+7.4VDC  (via drill 0.5)
  Top 0.254: 40.44,7.31 40.44,7.29 40.46,7.27
  Top 0.61: F2.P$2 66.63,10.62 65.86,10.36 TPFUSE2B.MP | v56.87,8.51 56.8,8.51 56.8,9.22 | 56.92,8.56 56.8,9.22 | 56.8,9.22 43.66,9.17 42.44,10.52 42.44,10.77 41.68,11.2 40.92,11.2 40.41,10.92 40.26,10.72 40.17,10.2 40.17,7.61 40.46,7.32 CON5.P$6
  Top 1.422: 40.44,7.31 40.44,5.98 | 40.44,5.98 40.44,4.87 | CON5.P$6 40.44,5.98
  Bottom 0.254: 40.42,6.13 40.42,5.82 40.45,5.95 CON5.P$6
  Bottom 0.61: TPFUSE2B.MP 65.36,8.48 64.9,8.03 57.46,8.03 v56.87,8.51
  Bottom 1.27: 40.42,6.63 CON5.P$6 40.42,6.13
ADC-CURRENT
  Top 0.229: 46.03,41.96 46.03,46.56
  Top 0.254: TP-A11-UNUSED.MP 47.15,40.82 46.03,41.96 | R17.2 47.17,47.7 46.03,46.56
ADS
  Top 0.813: Q3.3 66.94,28.23 66.96,25.6 66.4,25.53 66.62,25.35 D2.C
CE
  Top 0.229: 28.27,56.95 28.27,59.49
  Top 0.305: CON1.3 14.27,52.87 15.39,54.15 25.43,54.15 28.27,56.95 | 28.27,59.49 28.73,59.99 30.35,59.99 U1.9
CSN
  Top 0.254: 23.9,51.59 18.9,51.61 15.27,51.61
  Top 0.305: U1.10 29.53,56.73 24.21,51.61 23.95,51.61 23.9,51.59 | 15.27,51.61 14.5,51.05 CON1.4
ENABLE
  Top 0.254: Q5.2 68.43,17.5 69.62,17.5 | 69.62,17.5 70.13,17.5 70.56,18.01 IC1.3 | R13.1 69.62,17.5
FAN  (via drill 0.38)
  Top 0.305: v78.92,34.9 79.12,35.71 79.78,36.65 79.76,36.88 79.76,40.28 81.31,42.77 81.31,52.32 77.24,58.93
  Top 0.356: R41.1 65.37,58.91 70.94,58.93 77.24,58.93
  Top 1.422: CON5.P$9 34.39,5.98 | 34.39,5.98 34.39,7.34 | 34.39,5.98 34.44,4.8 34.47,4.59
  Bottom 0.254: CON5.P$9 34.42,5.99 34.42,6
  Bottom 0.305: 53.58,4.86 53.67,4.97 | 54.56,5.15 54.52,5.13 72.21,5.13 80.6,13.51 80.6,34.14 v78.92,34.9
  Bottom 0.356: 53.67,4.97 54.56,5.15 | 34.29,4.68 34.71,4.8 34.75,4.06 35.56,4.06 52.79,4.06 53.58,4.86
  Bottom 0.406: 34.29,4.68 34.67,5.73 CON5.P$9
  Bottom 1.27: 34.39,6.11 34.39,6.98 34.42,7.01 34.42,6 34.42,4.55
FAULT  (via drill 0.5)
  Top 0.305: v51.33,60.88 R18.1
  Bottom 0.305: U1.1 52.39,59.95 v51.33,60.88
GND  (via drill 0.38, 0.5)
  Top 0.229: 43.49,59.23 43.49,57.12 | 51.11,40.21 51.11,43.74
  Top 0.254: T1.E 10.05,21.18 v10.06,22.1
  Top 0.305: 41.45,68.58 41.48,68.61 | 42.41,67.54 42.41,67.55 | R16.2 49.85,39.2 51.11,40.21 | 51.11,43.74 51.72,44.5 52.86,44.5 53.75,43.61 54.36,43.61 U1.AGND | C21.2 53.8,47.53 C14.2 | v52.1,50.34 50.83,49.84 50.32,49.33 49.55,49.33 C5.2
  Top 0.356: 76.33,32.46 76.23,32.56 | 43.49,57.12 43.5,57.09 43.44,57.09 | CON5.P$4 44.42,4.62 44.37,4.14 54.38,4.14 55.02,4.24
  Top 0.406: NTC1.2 39.13,39.28 v39.65,39.8 39.85,39.6 39.85,38.96 40.26,38.56 40.26,38.51 40.31,38.46
  Top 0.457: v72.34,19.89 72.34,19.18 v72.34,18.16
  Top 0.508: IC1.2 72.52,19.05 72.34,19.18 | T2.E 68.33,13.79 v69.88,12.37
  Top 0.61: 23.14,4.88 15.52,5.38 8.66,10.34 8.79,10.46 | 8.79,10.46 8.36,10.34 | 8.79,10.46 5.87,10.46 3.58,13 3.61,24.82 18.09,24.82 18.06,30.28 | v39.73,56.21 39.73,55.5 38.33,54.1 38.33,52.38 38.43,52.27
  Top 1.016: 57.33,7.11 57.38,7.06
  Top 1.27: 42.41,67.54 42.32,67.54 42.32,64.95
  Bottom 0.305: v81.31,10.97 82.32,11.99 82.32,36.63 80.93,35.99 | 78.64,38.41 73.69,38.41 73.56,39.17
  Bottom 0.61: v16.54,37.64 26.34,37.64 26.59,37.39 26.59,36.83 27.76,35.66 28.07,35.66 28.22,35.51 30.05,35.51 31.57,37.03 31.57,37.8 32.89,37.8 | 33.4,37.8 32.89,37.8 | 32.89,37.8 33.43,37.95 35.31,37.95 37.8,37.46 50.12,37.41 51.99,35.53 54,35.48 54.84,34.65 56.21,34.65 57.05,35.23 58.01,35.23 60.61,33.53 60.99,33.53 63.58,30.94 | v53.37,56.69 v56.67,56.69 57.43,57.45 57.43,58.22 57.68,58.22
  other vias: 6.35,60.53 8.92,45.26 11.46,45.26 13.87,47.93 16.54,45.26 8.92,42.72 11.46,42.72 14,42.72 16.54,42.72 6.38,35.1 8.92,35.1 11.46,35.1 14,35.1 16.54,35.1 16.54,32.56 16.54,30.02 16.54,27.48 14,27.48 11.46,27.48 8.92,27.48 6.38,27.48 6.38,30.02 6.38,32.56 44.48,56.44 21.62,47.8 21.62,49.07 22.38,46.28 22.38,45.01 21.11,52.88 22.38,52.88 7.7,53.95 38.43,52.3 76.25,14.3 26.44,49.33 58.57,47.55 33.55,48.56 30.25,52.38 44.7,51.6 43.21,40.18 41.43,48.18 37.24,48.69 61.9,40.79 60.83,40.79 8.92,37.64 11.46,37.64 14,37.64 8.92,30.02 11.46,30.02 14,30.02 11.46,32.56 69.04,46.94 70.79,46.99 76.73,43.48 75.34,43.48 73.81,43.48 75.46,49.71 78.39,49.71 76.99,49.71 69.88,30.02 71.15,30.02 72.42,30.02 72.42,31.29 76.23,31.29 72.42,28.75 71.15,28.75 71.15,27.48 72.42,27.48 68.61,41.45 68.61,40.18 71.27,13.26 65.94,12.5 64.59,12.45 74.96,21.13 69.88,27.48 69.88,28.75 68.61,28.75 68.61,30.02 67.34,30.02 67.34,31.29 68.61,31.29 69.88,31.29 71.15,31.29 71.15,32.56 69.88,32.56 68.61,32.56 67.34,32.56 66.07,32.56 66.07,31.29 73.69,27.48 73.69,28.75 73.69,30.02 73.69,31.29 72.42,32.56 54.64,51.61 68.99,49.58 52.1,52.88 53.37,52.88 54.64,52.88 62.26,51.61 60.99,51.61 55.91,50.34 52.1,51.61 53.37,51.61 55.91,52.88 57.18,52.88 59.72,51.61 63.53,51.61 66.83,50.72 69.88,63.04 71.15,63.04 72.42,63.04 73.69,63.04 74.96,63.04 60.73,58.22 71.15,60.5 54.64,63.04 55.91,63.04 52.1,63.04 53.37,63.04 63.4,63.04 64.8,60.88 74.96,60.5 73.69,60.5 72.42,60.5 50.83,64.38 48.29,56.69 50.83,56.69 67.34,57.71 62,63.04 1.55,55.42 1.55,52.88 1.55,50.34 1.55,47.8 1.55,45.26 1.3,30.02 1.3,27.48 1.3,24.94 1.3,22.4 1.3,19.86 1.3,17.32 1.3,14.78 15.27,4.62 16.54,4.62 17.81,4.62 19.08,4.62 20.35,4.62 21.62,4.62 7.65,7.16 7.65,4.62 5.11,9.7 1.3,12.24 8.92,4.62 10.19,4.62 2.57,10.97 14,4.62 76.23,4.62 31.53,64.74 65.94,23.67 73.69,45.26 74.96,45.26 76.23,45.26 77.5,45.26 76.23,46.53 74.96,37.64 76.23,37.64 69.88,41.45 71.15,41.45 54.64,50.34 53.37,50.34 59.72,50.34 60.99,50.34 62.26,50.34 63.53,50.34 65.3,50.72 77.5,46.53 74.96,46.53 73.69,46.53 78.77,52.88 74.96,52.88 68.61,63.04 63.4,60.88 64.8,63.04 66.07,63.04 67.34,63.04 57.43,47.55 57.43,46.28 15.27,59.36 16.54,59.36 17.81,59.36 7.62,60.53 72.8,16.43 74.96,14.27 74.96,13.26 69.88,13.51
  pour Top (isolate 0.406): 84.41,41.05 56.11,40.84 55.96,35.81 56.11,35.66 61.39,35.66 63.63,33.43 63.63,9.75 60.38,9.4 53.57,9.4 43.36,9.45 43.46,-3.25 84.48,-2.79
  pour Bottom (isolate 0.406): 2.69,25.83 14,25.83 14.07,-2.9 2.59,-2.64
  pour Bottom (isolate 0.61, rank 2): 59.72,55.17 59.72,71.93 -3.78,71.93 -3.78,70.66 -3.28,24.94 18.82,24.94 18.82,54.91 19.08,55.17 58.95,55.17 59.21,55.42
  pour Bottom (isolate 0.61): 12.75,6.71 29.44,6.71 29.74,6.91 59.8,7.13 59.72,-2.23 29.74,-2.36 29.74,1.85 13.74,1.85 11.2,2.08
  pour Bottom (isolate 0.406): 63.12,19.2 80.37,19.36 83.11,19.25 83.44,-1.73 63.12,-1.73
  pour Bottom (isolate 0.61): 62.89,71.55 86.41,71.7 86.49,-2.49 63.5,-2.49 63.22,33.78 61.11,35.89 61.11,37.19 61.19,55.63 70.38,55.68 62.26,55.68 62.26,57.71 62.38,57.71 62.38,69.9
  pour Bottom (isolate 0.61, rank 2): 2.94,73.59 65.58,73.59 65.48,70.99 65.48,56.01 65.66,55.83 2.26,55.83 2.19,55.91
  pour Bottom (isolate 0.406): -1.75,-2.23 -1.4,62.08 6.22,62.84 5.46,4.78 5.06,4.37 5.06,-3.45
  pour Top (isolate 0.61, rank 6): 0.9,73.66 84.46,73.38 85.12,37.64 1.3,37.64
  pour Top (isolate 0.406, rank 6): 2.31,37.39 18.31,37.39 18.31,24.94 18.06,24.69 2.57,24.69 2.31,24.94
  pour Top (isolate 0.406, rank 6): -0.18,29.11 -0.18,62.38 0.33,62.89 7.49,62.89 7.85,63.25 7.9,63.25 8.15,41.96 8.15,41.45 18.82,41.45 18.82,39.67 7.9,39.67 7.85,10.26 8.1,10.01 8.99,10.01 11.2,7.8 25.05,7.92 24.92,9.7 53.72,9.27 53.62,-3.89 32.54,-4.01 -0.23,-2.74
  pour Bottom (isolate 0.305): 19.84,56.49 33.05,56.49 33.05,56.44 71.4,56.44 71.27,37.01 68.73,37.13 56.16,36.88 56.01,38.76 19.94,38.76
  pour Top (isolate 0.305, no thermals): 43.87,7.57 43.92,7.87 44.93,7.87 44.93,3.86 43.87,3.86 43.82,3.91 43.82,7.42
  pour Top (isolate 0.305, no thermals): 49.91,7.11 49.86,7.06 49.86,5.31 51.54,5.31 51.44,5.41 51.44,7.11
HEAT
  Top 0.305: 55.11,56.22 56.38,55.23 56.42,55.19 | TP-HEAT.MP 68.93,52.89 R7.2
  Top 0.406: 55.11,56.22 U1.0 | TP-HEAT.MP 66.31,52.89 65.94,52.88 61.88,52.88 58.65,52.91 57.63,54.05 57.48,54.26 56.49,55.22 56.62,55.12 56.42,55.19
HEATER  (via drill 0.38, 0.5)
  Top 0.305: v78.84,33.71 78.06,34.49 78.06,35.43 79.15,37.06 79.15,40.44 80.34,42.88 80.34,52.48 79.88,53.29 76.94,58.12 70.33,58.01 v70.13,57.81 | v70.23,53.59 70.23,51.71 69.93,51.41 68.9,51.41 R7.1
  Top 1.27: CON5.P$8 36.45,7.52 36.45,4.75
  Bottom 0.305: 52.49,5.84 72.01,5.84 79.88,13.72 79.83,32.97 v78.84,33.71
  Bottom 0.356: 52.49,5.84 52.13,5.07 51.77,4.86 50.94,4.75 36.45,4.75 36.45,5.49
  Bottom 0.406: v70.13,57.81 70.23,57.76 v70.23,53.59
  Bottom 1.27: 36.45,5.49 36.45,7.52 CON5.P$8
HFANCNTL  (via drill 0.38, 0.5)
  Top 0.254: R40.2 13.6,8.02 9.63,11.48 6.63,11.48 v4.8,13.72 | v18.24,55.7 12.68,55.7 11.96,55.04
  Top 0.305: 11.96,55.04 11.58,55.04 10.44,53.9 10.44,51.56 6.63,51.56 v6.63,57.1
  Bottom 0.229: 43.21,57.02 38.43,57.02 38.43,59.79
  Bottom 0.254: 18.24,55.73 18.14,55.75 v18.24,55.7
  Bottom 0.305: U1.4 44.41,58.28 43.21,57.02
  Bottom 0.406: v4.8,13.72 4.14,14.68 4.14,16.31 4.09,48.56 4.09,56.31 5.36,57.58 6.25,57.58 v6.63,57.1 | 38.43,59.79 23.62,59.79 19.84,55.8 18.31,55.8 18.24,55.73
HI-SHUNT  (via drill 0.5)
  Top 0.254: R2.2 6.42,22.24 5.82,22.2 v5.21,22.2
  Bottom 0.254: v5.21,22.2 5.23,22.28 4.85,22.66 | 4.88,55.93 4.88,55.96 | 39.65,58.22 U1.6
  Bottom 0.406: 4.85,22.66 4.88,55.93 | 4.88,55.96 5.11,56.19 8.66,56.19 9.42,56.69 10.19,56.69 10.87,57.45 18.97,57.45 22.15,60.66 36.86,60.66 39.4,60.63 39.65,58.22
LD1-R  (via drill 0.5)
  Top 0.305: LD1.2-CATH-RED 1.15,37.68 0.64,37.95 0.64,56.95 1.61,58.39 1.87,58.61 2.62,58.8 4.41,59.42 4.72,59.73 4.72,59.75 6.52,62.46 6.57,62.52 v8.46,62.53
  Bottom 0.305: v8.46,62.53 8.46,62.48 | 49.91,58.34 U1.2
  Bottom 0.356: 22,61.77 39.78,61.77 40.67,61.01 48.49,61.01 49.91,59.59 49.91,58.34
  Bottom 0.406: 8.46,62.48 9.98,60.45 19.23,60.45 22,61.77
LFANCNTL
  Top 0.305: R41.2 63.18,58.87 59.79,60.35 53.25,60.36 51.89,59.64 49.4,59.64 49.05,59.28 48.32,59.28 U1.3
LO-SHUNT  (via drill 0.38)
  Top 0.229: 43.49,43.99 43.49,41.96
  Top 0.254: U1.5 42.23,53.35 42.7,51.82 42.7,44.5 43.49,43.99 | 43.49,41.96 42.19,40.69 42.19,37.64 42.95,36.88 50.32,36.88 51.84,35.36 55.14,35.36 v55.7,35.66 | R27.2 v63.12,33.22
  Bottom 0.254: 60.96,34.37 58.37,36.27
  Bottom 0.406: v63.12,33.22 62.33,33.55 61.44,34.29 61.37,34.37 60.96,34.37 | 58.37,36.27 56.57,36.3 v55.7,35.66
MICRO+3.3V  (via drill 0.5)
  Top 0.305: R8.1 2.35,42.43 3.2,41.58 3.2,39.93 3.58,39.55 17.3,39.55 v18.44,40.18
  Top 0.381: 34.11,36.04 36.15,36.04
  Top 0.406: 34.11,36.04 33.17,37.13 33.17,37.64 30,40.82 23.01,40.82 v20.22,43.61 19.33,44.5 19.33,47.68 19.08,47.93 17.36,47.93 C18.1 17.3,47.87 17.3,48.56 16.79,49.07 16.79,50.27 CON1.2 | 36.15,36.04 36.45,36.12 49.81,36.12 51.21,34.72 56.8,34.72 56.8,36.37 55.53,37.64 55.53,38.79 54,40.31 53.11,40.31 52.48,40.95 52.48,42.95 U1.3.3V
  Bottom 0.305: v18.44,40.18 19.97,41.83 20.09,42.98 20.09,43.74 v20.22,43.61
MISO
  Top 0.305: CON1.7 9.19,54.42 11.38,56.62 22.05,56.62 U1.12
MOSI
  Top 0.254: 12.98,53.64 12.98,51.3
  Top 0.305: U1.11 27.01,57.14 24.87,54.79 13.95,54.79 12.98,53.64 | 12.98,51.3 CON1.6
N$1
  Top 0.305: R18.2 59.72,61.52 59.84,61.65 59.84,62.15 59.72,62.53 59.95,62.53 LD3.ANODE
N$2
  Top 0.61: TCO1.MP 67.44,8.69 67.44,8.28 66.12,8.28 66.12,8.33
  Top 0.813: 66.12,8.33 63.58,8.33 D1.A
N$3
  Top 0.406: R22.1 34.57,43.08 U1.17/A3 34.57,43 34.57,39.67 37.11,37.13 NTC1.1
N$5  (via drill 0.5)
  Top 0.254: 6.88,16.26 6.71,16.97 Q2.1
  Top 0.305: v8.92,18.9 9.16,18.95
  Top 0.406: T1.C 8.74,23.29 9.42,23.98 10.44,23.98 11.1,23.32 11.1,19.46 11,19.36 11,19.3 10.75,19.05 10,19.05 R1.1
  Top 0.61: 6.88,16.26 v7.29,15.44 | 9.16,18.95 R1.1
  Bottom 0.305: 8.79,18.62 v8.92,18.9
  Bottom 0.61: v7.29,15.44 8.79,18.62
N$9
  Top 0.305: 23.65,11.99 23.9,11.98 R5.1
  Top 0.813: Q1.3 26.87,8.26 23.65,11.99
N$13  (via drill 0.38, 0.5)
  Top 0.254: U1.8 v34.36,54.88
  Top 0.305: 82.07,52.93 82.07,42.34 80.42,40.06 80.42,38.79 81.56,38.15 81.69,38.02 81.69,35.48 LD2.3-CATH-GRN | v59.21,56.62 v76.58,56.62
  Top 0.356: 82.07,52.93 82.07,54.94 v80.37,56.64
  Bottom 0.254: 58.12,54.86 57.96,54.89 58.14,54.86
  Bottom 0.305: v34.36,54.88 35.59,54.36 38.74,54.36 38.99,54.74 40.41,54.74 40.62,54.86 58.12,54.86 | 58.14,54.86 58.65,55.63 v59.21,56.62
  Bottom 0.356: v80.37,56.64 v76.58,56.62
N$14  (via drill 0.38, 0.5)
  Top 0.254: U1.7 37.02,57.88 v36.96,55.3 | v77.39,55.55 77.34,55.65 77.04,55.7 63.1,55.68 58.29,55.66 v57.68,55.8 | v57.68,55.8 57.68,55.93 v57.68,55.8 | 57.56,55.53 v57.68,55.8
  Top 0.305: LD2.2-CATH-RED 79.83,33.45 79.83,35.51 80.16,35.99 80.8,35.99 80.93,36.12 80.93,37.39 v80.67,37.39
  Bottom 0.254: 57.43,55.52 57.53,55.63 57.53,55.65
  Bottom 0.305: v36.96,55.3 37.29,55.45 38.63,55.35 40.16,55.35 40.41,55.57 57.43,55.52 | 57.53,55.65 v57.68,55.8 | 77.75,55.45 v77.39,55.55
  Bottom 0.356: 82.25,55.47 77.75,55.45
  Bottom 0.406: v80.67,37.39 82.32,38.02 82.32,54.28 82.25,55.47
N$19
  Top 0.305: R8.2 LD1.1-ANODE
N$20
  Top 0.406: 70.69,10.57 71.71,10.57 TC02.MP
  Top 0.813: F2.P$1 70.69,10.57
N$21
  Top 0.254: R40.1 26.05,6.26 Q1.1
N$23
  Top 0.305: R27.1 64.39,29.61 Q3.1
N$24  (via drill 0.38, 0.5)
  Top 0.254: C23.1 71.27,16.56 70.64,15.93 69.93,15.54 R13.2
  Top 0.305: S4.3 S4.4 76.93,20.15 v76.91,19.15 | R12.2 65.22,15.51 65.53,15.13 65.53,15.22 65.84,14.76 65.84,13.74 T2.B 67.15,12.38 v67.41,12.29 | R13.2 v68.48,15.62
  Top 0.406: R11.1 R12.2 65.01,15.58 | 68.35,15.62 68.35,15.67 | v65.56,15.29 65.81,15.5 65.53,15.22 | v68.48,15.62 68.35,15.67 | 68.35,15.67 68.35,15.68
  Bottom 0.305: v76.91,19.15 77.62,19.1 77.62,14.27 71.68,8.33 70.64,8.33 70.28,8.69 70.28,9.09 70.26,9.14 | 67.46,12.24 v67.41,12.29
  Bottom 0.356: 70.26,9.14 67.46,12.24
  Bottom 0.406: v68.48,15.62 66.27,15.62 v65.56,15.29
N$26
  Top 0.254: 74.91,15.89 73.69,15.38 | 73.69,15.38 73.66,15.13 73.48,15.17 | IC1.4 73.81,18.1 73.81,15.9 73.81,15.47 73.81,15.58 73.64,15.58 73.69,15.38
  Top 0.356: 74.91,15.89 R19.1 | C7.1 72.95,14.66 73.36,15.06 73.48,15.17
N$27
  Top 0.61: Q5.1 67.08,17.73 | 67.08,17.73 T2.C | R14.1 67.04,17.13 67.08,17.73
N$28
  Top 0.254: T1.B 7.9,20.54 R2.1
N$31
  Top 0.305: HI-FAN.MP 18.56,10.95 R5.2
  Top 0.61: FAN1.2 15.42,13.36 16.54,12.24 18.05,12.24 R5.2
NTC1  (via drill 0.5)
  Top 0.229: 38.41,59.76 38.41,55.42
  Top 0.254: 38.41,55.42 37.36,54.41 37.36,54.15 37.34,51.28 38.63,48.82 38.63,45.52 39.23,45.17 R21.1 39.69,45.13 U1.19/A5
  Top 0.305: v37.9,64.19 37.87,64.06 | 37.9,60.24 38.41,59.76
  Top 0.406: C8.1 39.88,44.95 R21.1 | 37.87,64.06 37.9,60.24
  Top 1.27: CON2.P$3 46.43,65.88 46.38,65.84
  Bottom 0.61: v37.9,64.19 38,64.31 41.05,64.31 42.06,63.3 46.38,63.3 46.43,63.42 CON2.P$3
  Bottom 1.27: CON2.P$3 46.38,67.07 46.38,64.69
NTC1-7.4V  (via drill 0.38)
  Top 0.305: R3.1 61.96,42.09 59.97,42.09 59.72,41.83 59.72,40.69 61.11,37.13 v64.42,35.87
  Top 0.406: C12.1 37.36,43.25 U1.18/A4 37.15,39.58 NTC1-7.4V.MP | 46.38,7.8 46.38,8.33 53.49,8.33 v54.15,7.44
  Top 1.27: CON5.P$3 46.38,5.98 | 46.38,5.98 46.38,7.8 | 46.38,5.98 46.38,5.46
  Bottom 0.305: v54.15,7.44 56.36,7.16 56.54,7.16 56.62,7.19 56.69,7.14 71.45,7.11 78.56,14.22 78.56,31.62 74.68,34.29 74.65,34.29 73.46,34.24 72.95,34.75 71.45,34.75 69.88,36.12 64.67,36.12 | NTC1-7.4V.MP 38.33,38.3 40.16,38.25 50.01,38.25 52.05,40.23 53.93,40.23 56.67,37.49 57.18,37.49 57.33,37.34 58.6,37.34 59.92,36.12 64.67,36.12 | v64.42,35.87 64.67,36.12
  Bottom 1.27: CON5.P$3 46.42,6.47 46.41,5.94
NTC2  (via drill 0.38, 0.5)
  Top 0.229: 40.97,59.34 41,54.66
  Top 0.254: 41.46,59.99 40.97,59.34 | 41,54.66 41,54.46 v41.1,54 41.12,53.09 41.78,51.97 41.78,49.59 R39.1 | U1.21/A7 44.77,43.7 43.46,45.01 43.46,52.12 43.18,52.4 v43.18,54
  Top 0.305: 41.46,59.99 41.46,60.03 v42.32,62.15
  Top 0.406: C9.1 44.79,42.04 U1.21/A7 | v48.41,62.28 48.41,65.51
  Top 1.27: v48.41,62.28 48.41,67.08
  Bottom 0.254: 48.43,62.42 48.43,62.3 v48.41,62.28
  Bottom 0.356: v43.18,54 v41.1,54 | 48.29,62.15 v48.41,62.28
  Bottom 0.406: v42.32,62.15 48.29,62.15
  Bottom 1.27: CON2.P$2 48.43,62.42 48.41,64.06
NTC2-7.4V  (via drill 0.38, 0.5)
  Top 0.279: 82.32,19.68 82.32,39.55
  Top 0.305: v76.48,51.58 R4.1 | v73.79,50.06 73.25,50.16 72.89,50.57 C20.1 | U1.20/A6 42.23,42 41.07,40.84 41.07,39.22 v41.12,39.17 | 48.46,6.12 49.2,4.78 51.92,4.78 52.91,5.33 | 82.25,14.71 82.2,14.76 82.32,14.73 82.32,19.68 | 82.32,39.55 82.27,39.6 v81.38,39.6
  Top 0.356: 53.62,5.39 73.03,5.39 82.25,14.71
  Top 0.406: 48.44,5.03 48.46,6.12 | 52.91,5.33 53.56,5.33 53.62,5.39
  Top 1.27: 48.46,6.12 48.52,5.41 48.49,5.36 48.54,5.86 CON5.P$2
  Bottom 0.305: 76.79,51.56 76.46,51.59 v73.79,50.06 | v41.12,39.17 49.81,39.17 51.64,41 54.23,41 56.52,39.06 57.13,39.06 57.33,39.27 58.45,39.27 60.05,38.43 60.99,38.41 67.46,38.41 67.59,38.53 69.95,38.53 70.08,38.41 70.13,38.41 72.34,38.43 73.38,41.3 81.26,41.3 81.48,40.34 v81.38,39.6 81.56,40.69 81.54,51.56
  Bottom 0.406: 81.54,51.56 76.79,51.56 | v73.79,50.06 v76.48,51.58
  Bottom 1.27: CON5.P$2 48.42,5.91 48.44,6.45
NTC3  (via drill 0.38)
  Top 0.229: v35.87,41.2 35.84,49.33 | 35.87,57.33 35.89,59.34
  Top 0.305: 35.84,49.33 35.33,49.84 35.33,56.69 35.87,57.33 | 36.37,60.02 35.89,59.34 | v33.45,41.2 33.17,41.2 32.28,42.09 32.28,42.82 U1.16/A2
  Top 0.406: U1.16/A2 32.07,45.12 C10.1 30.66,45.33 R23.1 | 36.41,65.51 36.41,63.87 36.37,61.29 36.37,60.5 36.37,60.02
  Top 1.27: CON2.P$8 36.43,60.56 36.37,60.5
  Bottom 0.305: v33.45,41.2 v35.87,41.2
  Bottom 1.27: CON2.P$8 36.43,64.52 36.35,64.44
NTC3-7.4V  (via drill 0.38)
  Top 0.305: U1.15/A1 29.82,43.33 R6.1 30.13,48.91 C4.1
  Top 0.356: U1.15/A1 29.53,42.86 34.93,37.46 34.98,37.06 v35,36.93
  Top 0.406: 42.44,8.43 42.22,8.74 42.39,7.87
  Top 0.61: 41.63,9.45 v41.3,10.16
  Top 1.016: 42.22,8.74 41.63,9.45
  Top 1.27: 42.39,7.87 42.39,4.78 CON5.P$5
  Bottom 0.305: v41.3,10.16 38.89,10.16 38.63,10.36
  Bottom 0.356: v35,36.93 38.48,36.45 38.51,34.8 38.56,34.72 39.02,34.59 39.5,34.59 40.13,33.96 40.13,33.15 39.52,32.69 38.63,32.69 38.63,10.36
NTC4
  Top 0.229: 33.3,56.24 33.35,60.83
  Top 0.254: 33.3,56.24 33.12,55.88
  Top 0.406: C6.1 26.44,43.59 U1.14/A0 28.22,44.27 R26.1 24.9,45.33 24.87,50.04 30.74,55.88 33.12,55.88
  Top 1.27: 33.35,60.83 33.35,63.25 34.42,64.31 34.42,67.06 CON2.P$9 34.32,67.07
  Bottom 1.27: CON2.P$9 34.43,64.84 34.44,64.82
OPENFANBD-PIN  (via drill 0.5)
  Top 0.254: 32.36,7.01 32.33,7.01 32.34,7.01 32.36,7.01
  Top 1.422: CON5.P$10 32.44,5.98 32.39,6 32.36,4.62 32.36,7.01 31.09,7.01 v31.09,5.94
  Bottom 0.254: v31.09,5.94 31.09,5.9 31.09,5.89
  Bottom 0.305: 10.31,5.89 TO-FANBD.MP
  Bottom 0.406: 31.09,5.89 31.01,5.89 11.46,5.89 10.31,5.89
  Bottom 1.27: 31.01,5.89 31.01,6.73 31.09,6.81 31.14,6.71 32.41,6.66 32.36,4.68 32.39,5.71 32.39,5.13 31.67,5.84
PROT-3.7V  (via drill 0.5)
  Top 0.61: TPFUSE1A.MP 13.02,62.06 F1.P$1 12.9,61.08 12.8,61.85 12.78,58.22 5.36,58.22 5.36,43.23 7.14,41.45 19.84,41.45 19.84,36.63 v20.35,36.12 v21.36,36.12
  Top 1.27: v39.07,33.63 37.26,33.58 R28.1
  Bottom 0.61: 20.09,36.12 v21.36,36.12 21.69,36.12 25.68,33.58 v38.1,33.63 v39.07,33.63
  pour Top (isolate 0.61, rank 2, no thermals): 40.46,37.44 45.64,37.54 45.49,7.16 32.69,7.06 32.84,38.1
PROT-7.4V  (via drill 0.38, 0.5)
  Top 0.305: 66.07,20.39 C1.1 | 65.79,20.23 C1.1 | 70.13,21.69 69.98,22.05 | 66.88,20.73 66.41,20.6 C1.1 | R1.2 9.94,17.26
  Top 0.406: 9.46,16.81 R1.2
  Top 0.508: 67.59,22.05 66.88,20.73
  Top 0.61: 9.94,17.26 v9.98,14.99 | v44.81,10.31 45.24,10.24 57.56,10.24 57.79,9.52 58.29,8.79 59.26,8.79 59.36,8.48 D1.C 62.74,11.02 63.09,11.3 63.09,18.47 64.03,18.64 64.45,18.9 R11.2 R14.2 65.79,20.23 | C2.1 66.07,20.39 | 70.13,21.69 70.38,20.57 70.59,20.37 | 69.98,22.05 67.59,22.05 | Q2.3 9.46,16.81 | FAN1.1 13.38,17.57 12.98,17.17 10,17.17 R1.2 | IC1.1 70.96,20 70.59,20.37 | Q5.3 69.42,19.18 70.16,19.91 70.16,19.94 70.59,20.37
  Bottom 0.559: 37.97,9.17 44.8,9.17
  Bottom 0.61: v9.98,14.99 9.98,8.69 11.25,8.69 13.56,7.01 27.08,7.01 31.01,9.12 37.71,9.14 37.97,9.17 | 44.8,9.17 44.87,9.22 44.81,9.17 v44.81,10.31
SCALED3.7V
  Top 0.229: 46.03,59.11 46.03,57.4
  Top 0.254: 47.02,60.12 46.76,59.87 46.03,59.11 | 46.03,57.4 46,56.74 46,55.1 46,54.95 47.83,54.94 47.84,54.65 47.84,51.47 48.16,51.16 48.16,50.98 48.16,46.79 48.59,46.3 48.59,44.29 U1.22/A8
  Top 0.305: 44.41,65.51 44.41,65.9 | C22.1 47.99,54.67 47.84,54.65 | C5.1 48.16,51.04 48.16,50.98
  Top 0.406: R16.1 49.27,41.08 U1.22/A8
  Top 0.61: 46.76,59.87 46.76,62.41
  Top 1.27: CON2.P$4 44.41,67.07 44.41,65.51 44.41,65.08 46.76,63.42 46.76,62.41
SCALED7.4V  (via drill 0.5)
  Top 0.229: 56.21,43.99 56.21,42.16 57.02,41.35
  Top 0.305: 52.48,45.23 C14.1 54.28,45.68 R20.2 55.8,44.4 56.21,43.99 | 52.48,45.23 51.28,45.23 U1.23/A9 | 57.02,41.35 57.84,40.34 v57.84,38.3 | C21.1 52.5,45.25 52.48,45.23
  Top 1.27: CON5.P$7 38.43,7.52 38.48,4.73
  Bottom 0.305: v57.84,38.3 57.99,38.35 58.07,38.28 58.57,38.28 60.43,36.83 70.38,36.75 71.91,35.36 73.31,35.36 73.56,35.1 74.7,35.1 75.59,34.59 75.59,34.65 75.77,34.59 79.22,32.26 79.22,13.97 71.71,6.45 53.34,6.45 51.74,8.33
  Bottom 0.406: 51.74,8.33 38.38,8.33 38.38,8.03
  Bottom 0.61: 38.38,8.03 CON5.P$7
SCK  (via drill 0.5)
  Top 0.305: LD1.3-CATH-GRN 4.2,35.72 v5.84,37.24 5.84,38.79 v18.7,38.79 18.06,38.79
  Bottom 0.305: v5.84,37.24 5.77,37.24 5.74,37.26 | 5.72,55.17 5.87,55.32 | 11.86,52.95 CON1.5
  Bottom 0.406: 5.74,37.26 5.72,55.17 | 5.87,55.32 10.85,55.32 11.86,54.3 11.86,52.95 | U1.13 21.36,43.04 21.36,41.45 v18.7,38.79
SW-LOW  (via drill 0.5)
  Top 1.27: v54.64,21.13 56.83,21.13 D2.A
  other vias: 50.83,31.29 52.1,31.29 53.37,31.29 53.37,32.56 52.1,32.56 50.83,32.56 48.29,35.1 47.02,35.1 47.02,33.83 48.29,33.83 50.83,30.02 52.1,30.02 53.37,30.02 54.64,30.02 54.64,31.29 54.64,28.75 53.37,28.75 52.1,28.75 50.83,28.75 50.83,27.48 52.1,27.48 53.37,27.48 54.64,27.48 54.64,26.21 53.37,26.21 52.1,26.21 50.83,26.21 50.83,24.94 52.1,24.94 53.37,24.94 54.64,24.94 50.83,23.67 50.83,22.4 50.83,21.13 50.83,19.86 50.83,18.59 50.83,17.32 50.83,16.05 52.1,17.32 52.1,18.59 52.1,19.86 52.1,21.13 52.1,22.4 52.1,23.67 53.37,21.13 53.37,19.86 53.37,18.59 53.37,17.32 54.64,18.59 54.64,19.86 54.64,32.56 53.37,23.67 54.64,23.67 54.64,22.4 53.37,22.4 54.64,17.32 55.91,17.32 55.91,18.59 55.91,19.86 55.91,21.13 55.91,22.4 55.91,23.67 55.91,24.94 55.91,26.21 55.91,27.48 55.91,28.75 55.91,30.02 55.91,31.29 55.91,32.56 57.18,17.32 57.18,18.59 57.18,19.86 57.18,21.13 57.18,22.4 57.18,23.67 57.18,24.94 57.18,13.51 57.18,12.24 57.18,26.21 57.18,27.48 57.18,28.75 57.18,30.02 57.18,31.29 57.18,32.56 57.18,16.05 57.18,14.78 55.91,16.05 55.91,14.78 55.91,13.51 55.91,12.24
  pour Top (isolate 0.406, rank 3, no thermals): 45.75,38.41 62.46,38.25 62.66,8.99 45.7,9.25 45.7,36.68
  pour Bottom (isolate 0.406, rank 6): 38.13,37.64 58.29,37.64 62.41,33.53 62.71,7.47 62.66,7.32 55.91,7.16 38.13,7.16
SW-PROT-7.4V  (via drill 0.5)
  Top 1.016: Q2.2 5.87,18.85 5.11,18.8 5.11,15.44 6.75,13.66 6.88,13.51
  Top 1.27: 6.75,13.66 11.31,13.66 11.56,13.41
  other vias: 24.16,30.02 26.7,30.02 26.7,27.48 24.16,27.48 24.16,36.37 24.16,24.94 26.7,24.94 26.7,22.4 24.16,22.4 24.16,19.86 26.7,19.86 26.7,17.32 24.16,32.56 25.43,30.02 25.43,31.29 26.7,31.29 27.97,31.29 27.97,30.02 27.97,28.75 26.7,28.75 25.43,28.75 24.16,28.75 24.16,26.21 25.43,26.21 25.43,27.48 26.7,26.21 27.97,26.21 27.97,27.48 27.97,24.94 25.43,24.94 25.43,23.67 26.7,23.67 27.97,23.67 27.97,22.4 25.43,22.4 24.16,21.13 25.43,21.13 26.7,21.13 27.97,21.13 27.97,19.86 27.97,18.59 26.7,18.59 27.97,17.32 25.43,36.37 20.35,32.56 32.08,35.81 26.7,16.05 31.78,14.78 31.78,16.05 31.78,13.51 31.78,12.24 24.16,17.32 24.16,23.67 24.16,18.59 25.43,19.86 25.43,18.59 25.43,17.32 25.43,16.05 24.16,16.05 24.16,14.78 25.43,14.78 22.89,14.78 22.89,16.05 22.89,17.32 22.89,18.59 22.89,19.86 22.89,21.13 22.89,22.4 22.89,23.67 22.89,24.94 22.89,26.21 22.89,27.48 22.89,28.75 22.89,30.02 22.89,31.29 24.16,31.29 22.89,32.56 20.35,31.29 21.62,32.56 21.62,31.29 21.62,30.02 21.62,28.75 21.62,27.48 21.62,26.21 21.62,24.94 21.62,23.67 21.62,22.4 21.62,21.13 21.62,19.86 21.62,18.59 21.62,17.32 21.62,16.05 21.62,14.78
  pour Top (isolate 0.406, no thermals): 19.23,41.66 32.23,41.55 32.44,36.73 32.54,7.72 14.76,7.72 10.95,11.53 8.97,11.53 8.87,24.28 11.61,24.26 18.92,24.26 19.03,30.38
  pour Bottom (isolate 0.406, rank 5): 19.23,38.35 38.28,38.51 38.13,38.15 38.13,6.91 15.77,6.91 15.27,6.66 14.5,7.42 14.5,24.43 19.33,24.43
T
  Top 0.305: LD2.1-ANODE R9.2
UNUSED-ADC
  Top 0.254: C3.1 46.13,48.69 46.61,49.17 46.88,49.07 R17.1
  Top 0.406: C3.1 44.86,45.67 U1.A11 | 46.97,49.43 47.32,49.33 47.21,49.33 R17.1 46.46,49.92 R15.2
VBALANCE  (via drill 0.38)
  Top 0.305: POT1.2 71.66,39.04 v71.65,39.29
  Bottom 0.229: 48.57,42.19 48.57,44.3
  Bottom 0.305: v71.65,39.29 71.4,39.17 60.22,39.17 59.21,40.06 56.39,40.06 54.74,41.71 49.05,41.71 48.57,42.19 | 48.57,44.3 U1.A10
(copper drawn outside any net)
  shapes: Top area x1

### Text on the board
Top: Make this dimension 1.27mm or / 0.050in longer by making / entire board longer for better / connector mating
tPlace: Copyright 2015 Offgrid Systems LLC | AGND | GND
bPlace: FAULT | COMMS | ALIVE | DKblock / Block Manager PCB / Rev D / Copyright 2015 / Offgrid Systems LLC
bOrigins: NO COPPER HERE
tNames: RF24
bNames: 1 | 1
DrillLegend: LAYER-STACK
DrillLegend_01-16: 01-16
DrillLegend_01-20: 01-20